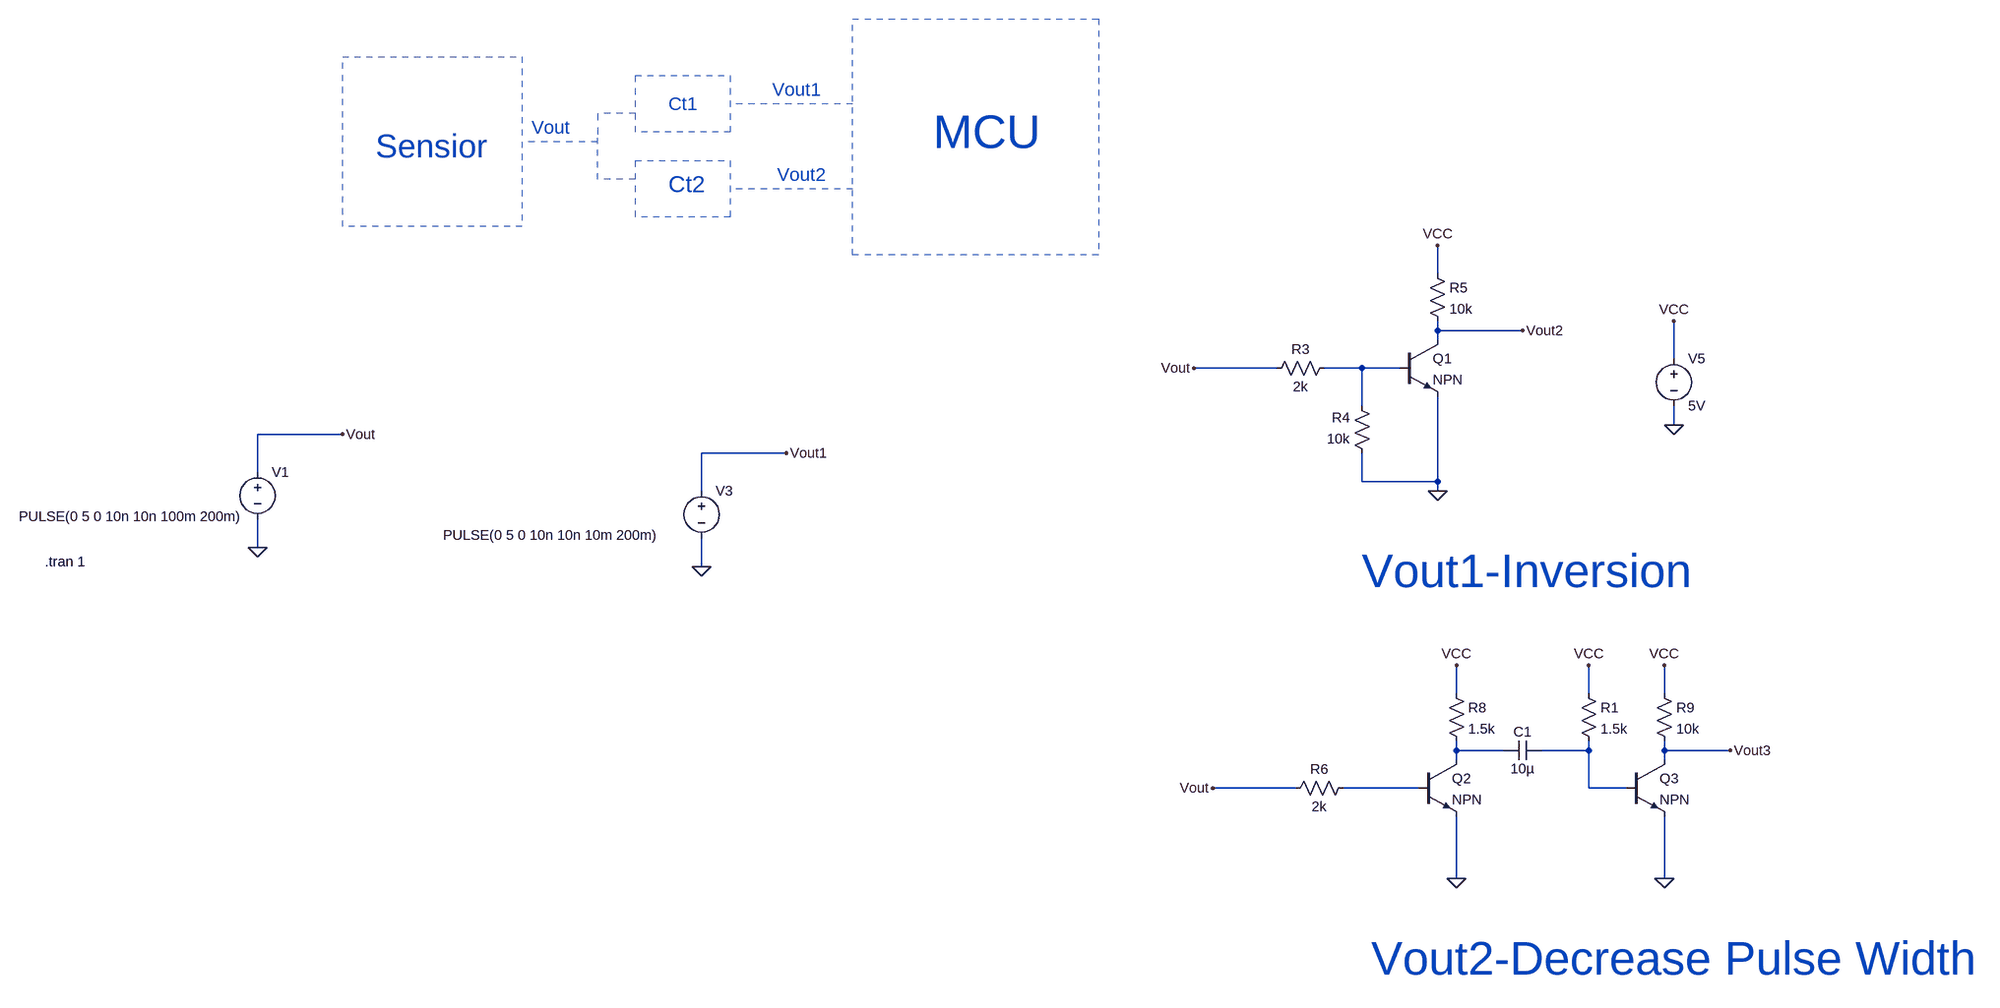
[diagram p0: schematic Wave Inversion and Pulse width Inversion.asc]
Wave Inversion and Pulse width Inversion.asc, the LTspice schematic file:
Version 4
SHEET 1 2608 1992
WIRE 1616 -208 1616 -256
WIRE 1616 -112 1616 -128
WIRE 1760 -112 1616 -112
WIRE 1616 -96 1616 -112
WIRE 2016 -64 2016 -128
WIRE 1344 -48 1200 -48
WIRE 1488 -48 1424 -48
WIRE 1552 -48 1488 -48
WIRE 1488 16 1488 -48
WIRE 2016 48 2016 16
WIRE -640 64 -784 64
WIRE 112 96 -32 96
WIRE -784 128 -784 64
WIRE 1488 144 1488 96
WIRE 1616 144 1616 0
WIRE 1616 144 1488 144
WIRE -32 160 -32 96
WIRE 1616 160 1616 144
WIRE -784 256 -784 208
WIRE -32 288 -32 240
WIRE 1648 672 1648 624
WIRE 1872 672 1872 624
WIRE 2000 672 2000 624
WIRE 1648 768 1648 752
WIRE 1728 768 1648 768
WIRE 1872 768 1872 752
WIRE 1872 768 1792 768
WIRE 2000 768 2000 752
WIRE 2112 768 2000 768
WIRE 1648 784 1648 768
WIRE 2000 784 2000 768
WIRE 1376 832 1232 832
WIRE 1584 832 1456 832
WIRE 1872 832 1872 768
WIRE 1936 832 1872 832
WIRE 1648 1040 1648 880
WIRE 2000 1040 2000 880
FLAG -784 256 0
FLAG -640 64 Vout
FLAG -32 288 0
FLAG 112 96 Vout1
FLAG 1616 -256 VCC
FLAG 2016 48 0
FLAG 2016 -128 VCC
FLAG 1200 -48 Vout
FLAG 1760 -112 Vout2
FLAG 1616 160 0
FLAG 1648 624 VCC
FLAG 1232 832 Vout
FLAG 1648 1040 0
FLAG 2000 624 VCC
FLAG 2000 1040 0
FLAG 2112 768 Vout3
FLAG 1872 624 VCC
SYMBOL voltage -784 112 R0
WINDOW 3 -404 91 Left 2
WINDOW 123 0 0 Left 0
WINDOW 39 0 0 Left 0
SYMATTR Value PULSE(0 5 0 10n 10n 100m 200m)
SYMATTR InstName V1
SYMBOL voltage -32 144 R0
WINDOW 3 -438 91 Left 2
WINDOW 123 0 0 Left 0
WINDOW 39 0 0 Left 0
SYMATTR Value PULSE(0 5 0 10n 10n 10m 200m)
SYMATTR InstName V3
SYMBOL npn 1552 -96 R0
SYMATTR InstName Q1
SYMBOL res 1440 -64 R90
WINDOW 0 0 56 VBottom 2
WINDOW 3 32 56 VTop 2
SYMATTR InstName R3
SYMATTR Value 2k
SYMBOL res 1504 112 R180
WINDOW 0 36 76 Left 2
WINDOW 3 36 40 Left 2
SYMATTR InstName R4
SYMATTR Value 10k
SYMBOL res 1600 -224 R0
SYMATTR InstName R5
SYMATTR Value 10k
SYMBOL voltage 2016 -80 R0
WINDOW 123 0 0 Left 0
WINDOW 39 0 0 Left 0
SYMATTR InstName V5
SYMATTR Value 5V
SYMBOL npn 1584 784 R0
SYMATTR InstName Q2
SYMBOL res 1472 816 R90
WINDOW 0 0 56 VBottom 2
WINDOW 3 32 56 VTop 2
SYMATTR InstName R6
SYMATTR Value 2k
SYMBOL res 1632 656 R0
SYMATTR InstName R8
SYMATTR Value 1.5k
SYMBOL cap 1792 752 R90
WINDOW 0 0 32 VBottom 2
WINDOW 3 32 32 VTop 2
SYMATTR InstName C1
SYMATTR Value 10µ
SYMBOL npn 1936 784 R0
SYMATTR InstName Q3
SYMBOL res 1984 656 R0
SYMATTR InstName R9
SYMATTR Value 10k
SYMBOL res 1856 656 R0
SYMATTR InstName R1
SYMATTR Value 1.5k
TEXT -1144 280 Left 2 !.tran 1
TEXT -584 -424 Left 5 ;Sensior
TEXT 360 -448 Left 6 ;MCU
TEXT -88 -360 Left 4 ;Ct2
TEXT -88 -496 Left 3 ;Ct1
TEXT 88 -520 Left 3 ;Vout1
TEXT 96 -376 Left 3 ;Vout2
TEXT -320 -456 Left 3 ;Vout
TEXT 1488 296 Left 6 ;Vout1-Inversion
TEXT 1504 1176 Left 6 ;Vout2-Decrease Pulse Width
LINE Normal -208 -432 -336 -432 2
LINE Normal -208 -480 -208 -432 2
LINE Normal -144 -480 -208 -480 2
LINE Normal -208 -368 -208 -448 2
LINE Normal -144 -368 -208 -368 2
LINE Normal 224 -496 16 -496 2
LINE Normal 224 -352 16 -352 2
RECTANGLE Normal 16 -448 -144 -544 2
RECTANGLE Normal 16 -304 -144 -400 2
RECTANGLE Normal 640 -240 224 -640 2
RECTANGLE Normal -336 -288 -640 -576 2

The netlist it stands for:
* Wave Inversion and Pulse width Inversion.asc
V1 Vout 0 PULSE(0 5 0 10n 10n 100m 200m)
V3 Vout1 0 PULSE(0 5 0 10n 10n 10m 200m)
Q1 Vout2 N001 0 0 NPN
R3 N001 Vout 2k
R4 0 N001 10k
R5 VCC Vout2 10k
V5 VCC 0 5V
Q2 N002 N004 0 0 NPN
R6 N004 Vout 2k
R8 VCC N002 1.5k
C1 N003 N002 10µ
Q3 Vout3 N003 0 0 NPN
R9 VCC Vout3 10k
R1 VCC N003 1.5k
.model NPN NPN
.model PNP PNP
.lib standard.bjt
.tran 1
* Sensior
* MCU
* Ct2
* Ct1
* Vout1
* Vout2
* Vout
* Vout1-Inversion
* Vout2-Decrease Pulse Width
.backanno
.end